# Altium project POVRotor.PrjPcb
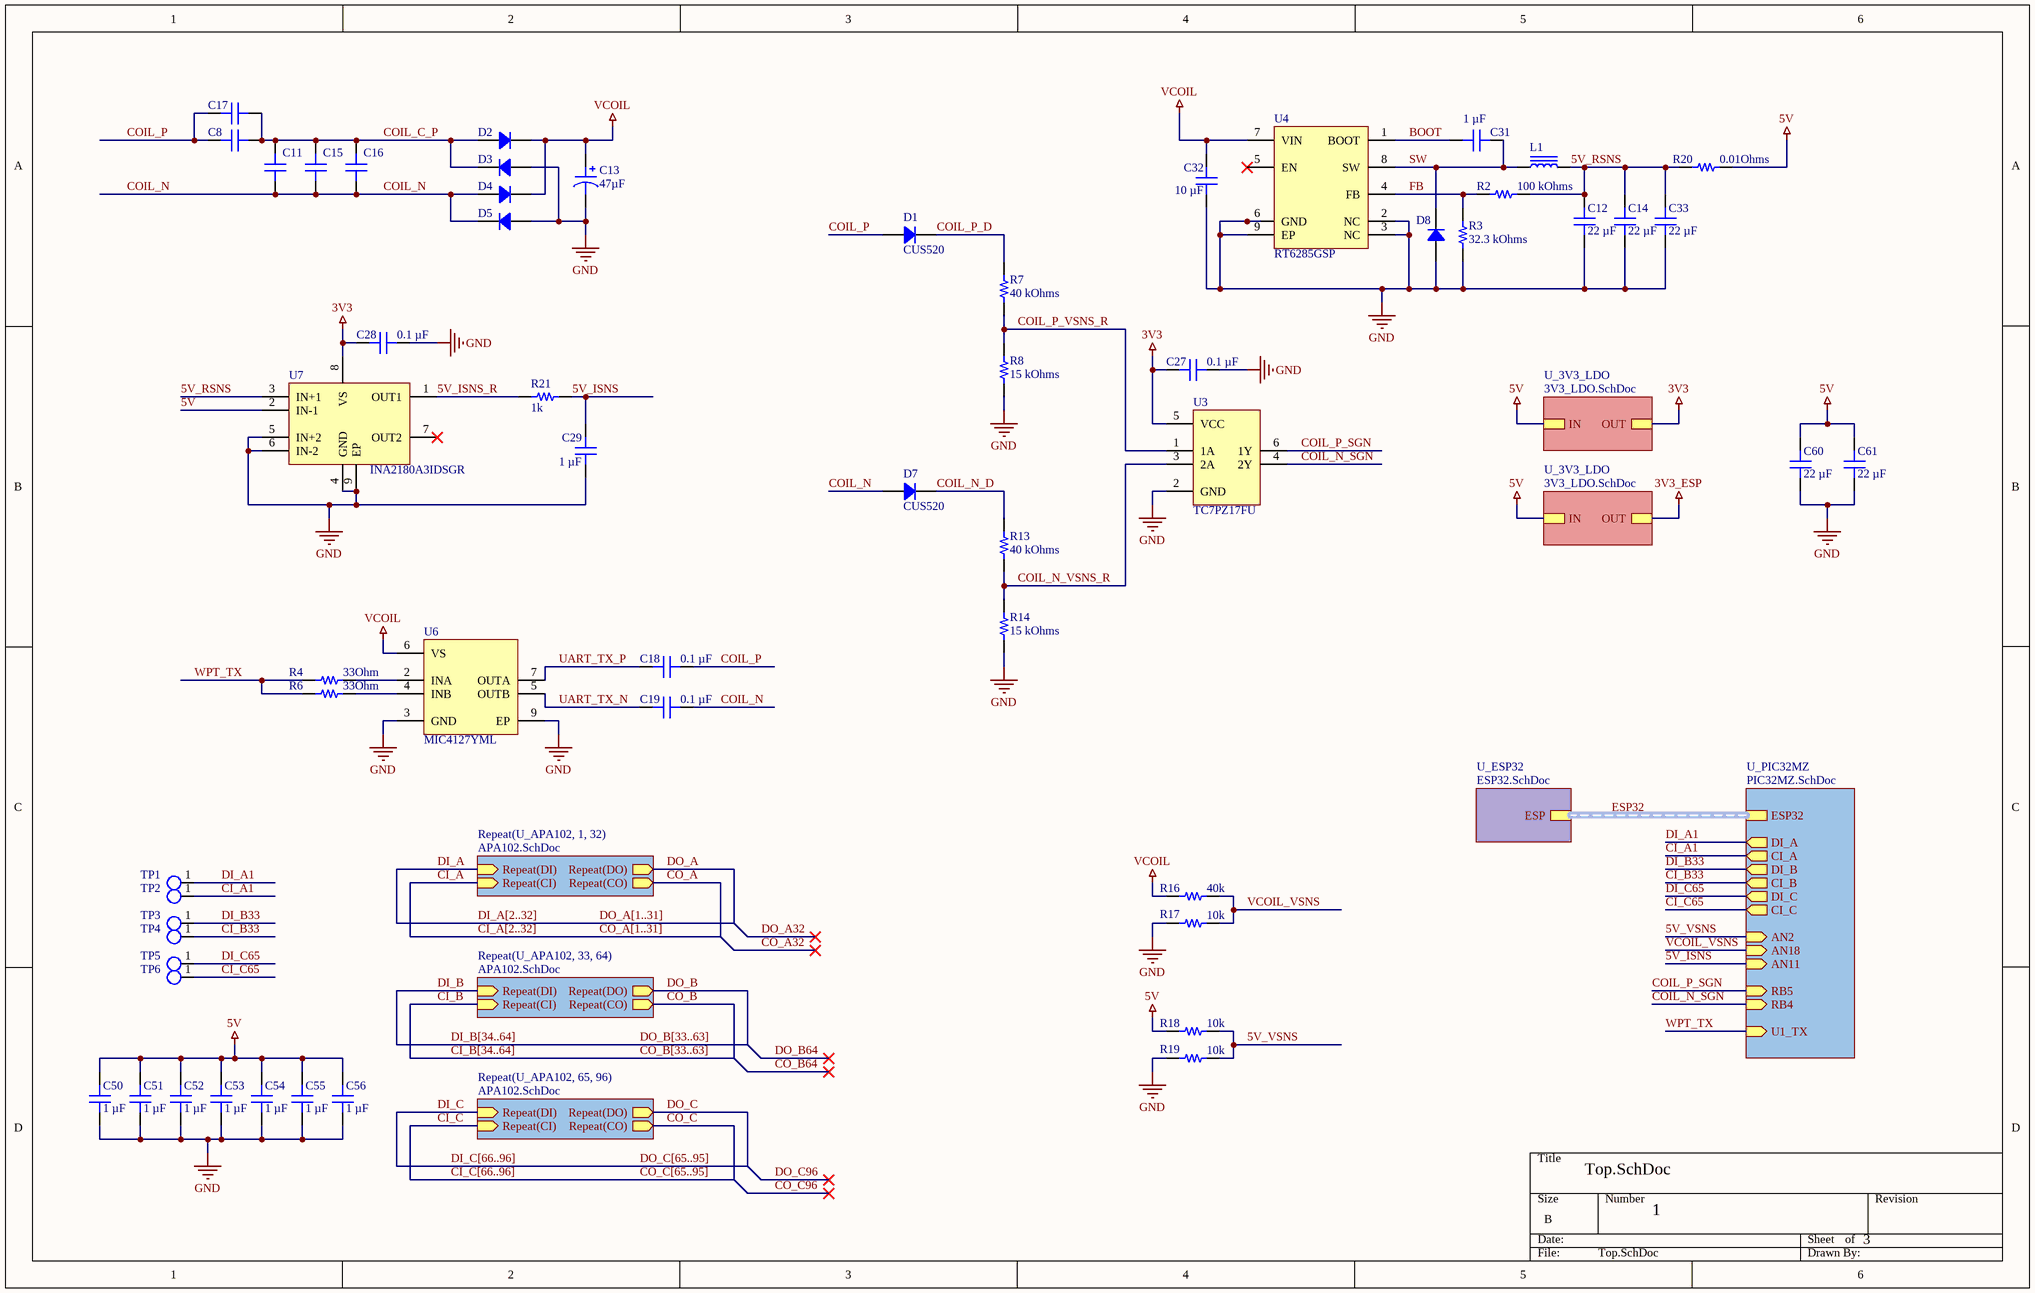
[diagram p0: Top.SchDoc]
4 sheets, 101 parts. Net scope: hierarchical (ports join the sheet entries above them; power ports are global).
Board file: POVRotor.PcbDoc
Sheets:
  Top.SchDoc
    U_ESP32 = ESP32.SchDoc
    U_PIC32MZ = PIC32MZ.SchDoc
    U_3V3_LDO = 3V3_LDO.SchDoc
    U_3V3_LDO = 3V3_LDO.SchDoc

## Sheet Top.SchDoc
size B; SheetNumber: 1; SheetTotal: 3

### Parts
C8  (no value)  [CAP 1206_3216 - 0.8MM]
C11  (no value)  [CAP 1206_3216 - 0.8MM]
C12  22 µF  [CAP 0603_1608]
C13  47µF  [CAP ALSMD 6.6MM H6.1MM]
C14  22 µF  [CAP 0603_1608]
C15  (no value)  [CAP 1206_3216 - 0.8MM]
C16  (no value)  [CAP 1206_3216 - 0.8MM]
C17  (no value)  [CAP 1206_3216 - 0.8MM]
C18  0.1 µF  [CAP 0402_1005]
C19  0.1 µF  [CAP 0402_1005]
C27  0.1 µF  [CAP 0402_1005]
C28  0.1 µF  [CAP 0402_1005]
C29  1 µF  [CAP 0402_1005]
C31  1 µF  [CAP 0402_1005]
C32  10 µF  [CAP 1210_3225 - 1MM]
C33  22 µF  [CAP 0603_1608]
C50  1 µF  [CAP 0402_1005]
C51  1 µF  [CAP 0402_1005]
C52  1 µF  [CAP 0402_1005]
C53  1 µF  [CAP 0402_1005]
C54  1 µF  [CAP 0402_1005]
C55  1 µF  [CAP 0402_1005]
C56  1 µF  [CAP 0402_1005]
C60  22 µF  [CAP 0603_1608]
C61  22 µF  [CAP 0603_1608]
D1  CUS520  [SOD323]
D2  STPS340UY  [DO214AA SMB]  (value not drawn)
D3  STPS340UY  [DO214AA SMB]  (value not drawn)
D4  STPS340UY  [DO214AA SMB]  (value not drawn)
D5  STPS340UY  [DO214AA SMB]  (value not drawn)
D7  CUS520  [SOD323]
D8  STPS340UY  [DO214AA SMB]  (value not drawn)
L1  MPL-AL5050-5R6  [MPL-AL5050-5R6]  (value not drawn)
R2  100 kOhms  [RES 0402_1005]
R3  32.3 kOhms  [RES 0402_1005]
R4  33Ohm  [RES 0402_1005]
R6  33Ohm  [RES 0402_1005]
R7  40 kOhms  [RES 0402_1005]
R8  15 kOhms  [RES 0402_1005]
R13  40 kOhms  [RES 0402_1005]
R14  15 kOhms  [RES 0402_1005]
R16  40k  [RES 0402_1005]
R17  10k  [RES 0402_1005]
R18  10k  [RES 0402_1005]
R19  10k  [RES 0402_1005]
R20  0.01Ohms  [RES 0805_2012]
R21  1k  [RES 0402_1005]
TP1  0.8mm  [TP  0.8mm]  (value not drawn)
TP2  0.8mm  [TP  0.8mm]  (value not drawn)
TP3  0.8mm  [TP  0.8mm]  (value not drawn)
TP4  0.8mm  [TP  0.8mm]  (value not drawn)
TP5  0.8mm  [TP  0.8mm]  (value not drawn)
TP6  0.8mm  [TP  0.8mm]  (value not drawn)
U3  TC7PZ17FU  [SOT-363]
U4  RT6285GSP  [8-SOIC Richtek]
U6  MIC4127YML  [VDFN-8 3x3x0.9]
U7  INA2180A3IDSGR  [SON50P200X200X80-9N]

### Sub-sheets
Repeat(U_APA102, 1, 32) = APA102.SchDoc (file not in this document): Repeat(DI) (in), Repeat(CI) (in), Repeat(CO) (out), Repeat(DO) (out)
Repeat(U_APA102, 33, 64) = APA102.SchDoc (file not in this document): Repeat(DI) (in), Repeat(CI) (in), Repeat(CO) (out), Repeat(DO) (out)
Repeat(U_APA102, 65, 96) = APA102.SchDoc (file not in this document): Repeat(DI) (in), Repeat(CI) (in), Repeat(CO) (out), Repeat(DO) (out)
U_3V3_LDO = 3V3_LDO.SchDoc: OUT, IN
U_3V3_LDO = 3V3_LDO.SchDoc: OUT, IN
U_ESP32 = ESP32.SchDoc: ESP (harness ESP)
U_PIC32MZ = PIC32MZ.SchDoc: ESP32 (harness ESP), DI_A (out), CI_A (out), DI_B (out), CI_B (out), DI_C (out), CI_C (out), AN18 (in), AN2 (in), RB5 (in), RB4 (in), AN11 (in), U1_TX (in)

### Nets
3V3: C27.2 C28.2 U3.5(VCC) U7.8(VS) ; sheet U_3V3_LDO/OUT
5V: C50.2 C51.2 C52.2 C53.2 C54.2 C55.2 C56.2 C60.2 C61.2 R18.2 R20.2 U7.2(IN-1) ; sheet U_3V3_LDO/IN, sheet U_3V3_LDO/IN
GND: C12.1 C13.2 C14.1 C27.1 C28.1 C29.2 C32.1 C33.1 C50.1 C51.1 C52.1 C53.1 C54.1 C55.1 C56.1 C60.1 C61.1 D3.1 D5.1 D8.1 R3.1 R8.1 R14.1 R17.2 R19.2 U3.2(GND) U4.2(NC) U4.3(NC) U4.6(GND) U4.9(EP) U6.3(GND) U6.9(EP) U7.4(GND) U7.5(IN+2) U7.6(IN-2) U7.9(EP)
VCOIL: C13.1 C32.2 D2.2 D4.2 R16.2 U4.7(VIN) U6.6(VS)
5V_ISNS: C29.1 R21.1 ; sheet U_PIC32MZ/AN11
5V_ISNS_R: R21.2 U7.1(OUT1)
5V_RSNS: C12.2 C14.2 C33.2 L1.2 R2.2 R20.1 U7.3(IN+1)
5V_VSNS: R18.1 R19.1 ; sheet U_PIC32MZ/AN2
BOOT: C31.2 U4.1(BOOT)
CI_A: sheet Repeat(U_APA102, 1, 32)/Repeat(CI)
CI_A1: TP2.1(TP) ; sheet U_PIC32MZ/CI_A
CI_B: sheet Repeat(U_APA102, 33, 64)/Repeat(CI)
CI_B33: TP4.1(TP) ; sheet U_PIC32MZ/CI_B
CI_C: sheet Repeat(U_APA102, 65, 96)/Repeat(CI)
CI_C65: TP6.1(TP) ; sheet U_PIC32MZ/CI_C
CO_A: sheet Repeat(U_APA102, 1, 32)/Repeat(CO)
CO_B: sheet Repeat(U_APA102, 33, 64)/Repeat(CO)
CO_C: sheet Repeat(U_APA102, 65, 96)/Repeat(CO)
COIL_C_P: C8.1 C11.2 C15.2 C16.2 C17.1 D2.1 D3.2
COIL_N: C11.1 C15.1 C16.1 C19.2 D4.1 D5.2 D7.1
COIL_N_D: D7.2 R13.2
COIL_N_SGN: U3.4(2Y) ; sheet U_PIC32MZ/RB4
COIL_N_VSNS_R: R13.1 R14.2 U3.3(2A)
COIL_P: C8.2 C17.2 C18.2 D1.1
COIL_P_D: D1.2 R7.2
COIL_P_SGN: U3.6(1Y) ; sheet U_PIC32MZ/RB5
COIL_P_VSNS_R: R7.1 R8.2 U3.1(1A)
DI_A: sheet Repeat(U_APA102, 1, 32)/Repeat(DI)
DI_A1: TP1.1(TP) ; sheet U_PIC32MZ/DI_A
DI_B: sheet Repeat(U_APA102, 33, 64)/Repeat(DI)
DI_B33: TP3.1(TP) ; sheet U_PIC32MZ/DI_B
DI_C: sheet Repeat(U_APA102, 65, 96)/Repeat(DI)
DI_C65: TP5.1(TP) ; sheet U_PIC32MZ/DI_C
DO_A: sheet Repeat(U_APA102, 1, 32)/Repeat(DO)
DO_B: sheet Repeat(U_APA102, 33, 64)/Repeat(DO)
DO_C: sheet Repeat(U_APA102, 65, 96)/Repeat(DO)
FB: R2.1 R3.2 U4.4(FB)
SW: C31.1 D8.2 L1.1 U4.8(SW)
UART_TX_N: C19.1 U6.5(OUTB)
UART_TX_P: C18.1 U6.7(OUTA)
VCOIL_VSNS: R16.1 R17.1 ; sheet U_PIC32MZ/AN18
WPT_TX: R4.1 R6.1 ; sheet U_PIC32MZ/U1_TX
NetR4_2: R4.2 U6.2(INA)
NetR6_2: R6.2 U6.4(INB)

Not connected (* = marked no-connect by the designer): U4 5(EN)*; U7 7(OUT2)*

### Buses and harness runs
bus CI_A[2..32] = CO_A[1..31]
bus CI_B[34..64] = CO_B[33..63]
bus CI_C[66..96] = CO_C[65..95]
bus DI_A[2..32] = DO_A[1..31]
bus DI_B[34..64] = DO_B[33..63]
bus DI_C[66..96] = DO_C[65..95]
harness ESP32 = sheet U_ESP32/ESP = sheet U_PIC32MZ/ESP32

### Library data of the parts
C8 C11 C15-C17 = C1206C223KBRAC7800: CAP CER 0.022UF 630V X7R 1206; manufacturer: KEMET; Capacitance: 0.022 µF; Tolerance: ±10%; Part Number: C1206C223KBRAC7800; Applications: General Purpose; componentlink1description: Datasheet; componentlink1url: https://api.kemet.com/component-edge/download/datasheet/C1206C223KBRAC7800.pdf; componentlink2description: DigiKey Link; componentlink2url: https://www.digikey.com/en/products/detail/kemet/C1206C223KBRAC7800/7382212; Device Package: 1206 (3216 Metric); Features: Low ESL, High Voltage; lastupdated: 9/29/2023 7:15:32 PM; Lifecycle Status: Active; Minimum Order: 1; Mounting Type: Surface Mount, MLCC; Operating Temperature: -55°C ~ 125°C; Package / Case: 1206 (3216 Metric); packaging: TapeAndReel; partid: 40769; Part Status: Active; price: 0.05; series: SMD Comm X7R HV; Size / Dimension: 0.126" L x 0.063" W (3.20mm x 1.60mm); Supplier 1: DigiKey; Supplier Part Number 1: 399-15097-1-ND; Temperature Coefficient: X7R; Thickness (Max): 0.075" (1.90mm); Voltage - Rated: 630V
C12 C14 C33 C60 C61 = 0603ZD226MAT2A: CAP CER 22UF 10V X5R 0603; manufacturer: KYOCERA AVX; Tolerance: ±20%; Part Number: 0603ZD226MAT2A; Value: 22 µF; Applications: General Purpose; Capacitance: 22 µF; componentlink2description: DigiKey Link; componentlink2url: https://www.digikey.com/en/products/detail/kyocera-avx/0603ZD226MAT2A/11268185; Device Package: 0603 (1608 Metric); lastupdated: 9/24/2023 7:08:40 PM; Lifecycle Status: Active; Minimum Order: 1; Mounting Type: Surface Mount, MLCC; Operating Temperature: -55°C ~ 85°C; Package / Case: 0603 (1608 Metric); packaging: TapeAndReel; partid: 35789; Part Status: Active; price: 0.13; series: -; Size / Dimension: 0.063" L x 0.032" W (1.60mm x 0.81mm); Supplier 1: DigiKey; Supplier Part Number 1: 478-0603ZD226MAT2ACT-ND; Temperature Coefficient: X5R; Thickness (Max): 0.035" (0.90mm); Voltage - Rated: 10V
C13 = EMHL160ARA470MF61G: ALUMINUM CAPACITOR; Manufacturer: United Chemi-Con; ESR (Equivalent Series Resistance): 1.2Ohm @ 100kHz; Lifetime @ Temp.: 2000 Hrs @ 125°C; Polarization: Polar; Ripple Current @ High Frequency: 110mA @ 100kHz; Ripple Current @ Low Frequency: 102.3mA @ 120Hz; Surface Mount Land Size: 0.260" L x 0.260" W (6.60mm x 6.60mm); Tolerance: ±20%; Voltage - Rated: 16V; Part Number: EMHL160ARA470MF61G; Applications: Automotive; Capacitance: 47µF; ComponentLink1Description: Datasheet; ComponentLink1URL: http://www.chemi-con.co.jp/cgi-bin/CAT_DB/SEARCH/cat_db_al.cgi?e=e&j=p&pdfname=mhl; ComponentLink2Description: DigiKey Link; ComponentLink2URL: http://digikey.com/product-detail/en/united-chemi-con/EMHL160ARA470MF61G/565-EMHL160ARA470MF61GCT-ND/10487181; Device Package: Radial, Can - SMD; Height - Seated (Max): 0.240" (6.10mm); LastUpdated: 9/2/2020 1:25:27 AM; Lifecycle Status: Active; Minimum Order: 1; Mounting Type: Surface Mount; Operating Temperature: -40°C ~ 125°C; Package / Case: Radial, Can - SMD; Packaging: TapeAndReel; PartId: 8133; Part Status: Active; Price: 0.15; Ratings: AEC-Q200; Series: AIchip™- MHL; Size / Dimension: 0.248" Dia (6.30mm); Supplier 1: DigiKey; Supplier Part Number 1: 565-EMHL160ARA470MF61GCT-ND; Value: 47µF
C18 C19 C27 C28 = C1005X5R1E104K050BC: CAP CER 0.1UF 25V X5R 0402; manufacturer: TDK Corporation; Tolerance: ±10%; Part Number: C1005X5R1E104K050BC; Value: 0.1 µF; Applications: General Purpose; Capacitance: 0.1 µF; componentlink1description: Datasheet; componentlink1url: https://product.tdk.com/info/en/catalog/datasheets/mlcc_commercial_general_en.pdf?ref_disty=digikey; componentlink2description: DigiKey Link; componentlink2url: https://www.digikey.com/en/products/detail/tdk-corporation/C1005X5R1E104K050BC/2093232; Device Package: 0402 (1005 Metric); Features: Low ESL; lastupdated: 9/24/2023 7:03:59 PM; Lifecycle Status: Active; Minimum Order: 1; Mounting Type: Surface Mount, MLCC; Operating Temperature: -55°C ~ 85°C; Package / Case: 0402 (1005 Metric); packaging: TapeAndReel; partid: 34396; Part Status: Active; price: 0.01; series: C; Size / Dimension: 0.039" L x 0.020" W (1.00mm x 0.50mm); Supplier 1: DigiKey; Supplier Part Number 1: 445-4964-1-ND; Temperature Coefficient: X5R; Thickness (Max): 0.022" (0.55mm); Voltage - Rated: 25V
C29 C31 = C1005X5R1E104K050BC: CAP CER 0.1UF 25V X5R 0402; manufacturer: TDK Corporation; Capacitance: 0.1 µF; Tolerance: ±10%; Part Number: C1005X5R1E104K050BC; Value: 1 µF; Applications: General Purpose; componentlink1description: Datasheet; componentlink1url: https://product.tdk.com/info/en/catalog/datasheets/mlcc_commercial_general_en.pdf?ref_disty=digikey; componentlink2description: DigiKey Link; componentlink2url: https://www.digikey.com/en/products/detail/tdk-corporation/C1005X5R1E104K050BC/2093232; Device Package: 0402 (1005 Metric); Features: Low ESL; lastupdated: 9/24/2023 7:03:59 PM; Lifecycle Status: Active; Minimum Order: 1; Mounting Type: Surface Mount, MLCC; Operating Temperature: -55°C ~ 85°C; Package / Case: 0402 (1005 Metric); packaging: TapeAndReel; partid: 34396; Part Status: Active; price: 0.01; series: C; Size / Dimension: 0.039" L x 0.020" W (1.00mm x 0.50mm); Supplier 1: DigiKey; Supplier Part Number 1: 445-4964-1-ND; Temperature Coefficient: X5R; Thickness (Max): 0.022" (0.55mm); Voltage - Rated: 25V
C32 = C1210X106K050T: CAP CER 10UF 50V X7R 1210; manufacturer: Holy Stone Enterprise Co., Ltd.; Tolerance: ±10%; Part Number: C1210X106K050T; Value: 10 µF; Applications: SMPS Filtering; Capacitance: 10 µF; componentlink1description: Datasheet; componentlink1url: https://www.holystonecaps.com/PDF/201612051328350.2017%20HCC%20Series.pdf; componentlink2description: DigiKey Link; componentlink2url: https://www.digikey.com/en/products/detail/holy-stone-enterprise-co-ltd/C1210X106K050T/16894866; Device Package: 1210 (3225 Metric); lastupdated: 10/13/2023 7:36:52 PM; Lifecycle Status: Active; Minimum Order: 1; Mounting Type: Surface Mount, MLCC; Operating Temperature: -55°C ~ 125°C; Package / Case: 1210 (3225 Metric); packaging: TapeAndReel; partid: 39935; Part Status: Active; price: 0.23; series: HCC; Size / Dimension: 0.126" L x 0.098" W (3.20mm x 2.50mm); Supplier 1: DigiKey; Supplier Part Number 1: 4587-C1210X106K050TCT-ND; Temperature Coefficient: X7R; Thickness (Max): 0.087" (2.20mm); Voltage - Rated: 50V
C50-C56 = GRM155R61C105MA12D: CAP CER 1UF 16V X5R 0402; manufacturer: Murata Electronics; Tolerance: ±20%; Part Number: GRM155R61C105MA12D; Value: 1 µF; Applications: General Purpose; Capacitance: 1 µF; componentlink1description: Datasheet; componentlink1url: https://search.murata.co.jp/Ceramy/image/img/A01X/G101/ENG/GRM155R61C105MA12-01.pdf; componentlink2description: DigiKey Link; componentlink2url: https://www.digikey.com/en/products/detail/murata-electronics/GRM155R61C105MA12D/4905131; Device Package: 0402 (1005 Metric); lastupdated: 9/24/2023 7:04:06 PM; Lifecycle Status: Active; Minimum Order: 1; Mounting Type: Surface Mount, MLCC; Operating Temperature: -55°C ~ 85°C; Package / Case: 0402 (1005 Metric); packaging: TapeAndReel; partid: 10295; Part Status: Active; price: 0.01; series: GRM; Size / Dimension: 0.039" L x 0.020" W (1.00mm x 0.50mm); Supplier 1: DigiKey; Supplier Part Number 1: 490-14599-1-ND; Temperature Coefficient: X5R; Thickness (Max): 0.022" (0.55mm); Voltage - Rated: 16V
D1 D7 = NSVRB751V40T1G: DIODE SCHOTTKY 30V 30MA SOD323; Manufacturer: ON Semiconductor; Capacitance @ Vr, F: 2.5pF @ 1V, 1MHz; Current - Average Rectified (Io): 30mA (DC); Current - Reverse Leakage @ Vr: 500nA @ 30V; Speed: Small Signal =< 200mA (Io), Any Speed; Voltage - DC Reverse (Vr) (Max): 40V; Voltage - Forward (Vf) (Max) @ If: 370mV @ 1mA; Part Number: NSVRB751V40T1G; ComponentLink1Description: Datasheet; ComponentLink1URL: https://www.onsemi.com/pub/Collateral/RB751V40T1-D.PDF; ComponentLink2Description: DigiKey Link; ComponentLink2URL: http://digikey.com/product-detail/en/on-semiconductor/NSVRB751V40T1G/NSVRB751V40T1GOSCT-ND/5969287; Diode Type: Schottky; LastUpdated: 9/30/2023 8:39:46 PM; Lifecycle Status: Active; Minimum Order: 1; Mounting Type: Surface Mount; Operating Temperature - Junction: -55°C ~ 150°C; Package / Case: SC-76, SOD-323; Packaging: TapeAndReel; PartId: 3084; Part Status: Active; Price: 0.12; Series: Automotive, AEC-Q101; Supplier 1: DigiKey; Supplier Part Number 1: NSVRB751V40T1GOSCT-ND; Supplier Device Package: SOD-323
D2-D5 D8 = STPS340UY: DIODE SCHOTTKY 40V 3A SMB; Manufacturer: STMicroelectronics; Current - Reverse Leakage @ Vr: 20µA @ 40V; Speed: Fast Recovery =< 500ns, > 200mA (Io); Voltage - Forward (Vf) (Max) @ If: 630mV @ 3A; Part Number: STPS340UY; ComponentLink1Description: Datasheet; ComponentLink1URL: http://www.st.com/content/ccc/resource/technical/document/datasheet/9d/f4/fa/9f/2c/39/45/91/CD00270569.pdf/files/CD00270569.pdf/jcr:content/translations/en.CD00270569.pdf; ComponentLink2Description: DigiKey Link; ComponentLink2URL: http://digikey.com/product-detail/en/stmicroelectronics/STPS340UY/497-13432-1-ND/3770079; Current - Average Rectified (Io): 3A; Diode Type: Schottky; LastUpdated: 9/2/2020 1:18:53 AM; Lifecycle Status: Active; Minimum Order: 1; Mounting Type: Surface Mount; Operating Temperature - Junction: -40°C ~ 150°C; Package / Case: DO-214AA, SMB; Packaging: TapeAndReel; PartId: 1402; Part Status: Active; Price: 0.30; Series: Automotive, AEC-Q101; Supplier 1: DigiKey; Supplier Part Number 1: 497-13432-1-ND; Supplier Device Package: SMB; Voltage - DC Reverse (Vr) (Max): 40V
L1 = MPL-AL5050-5R6: FIXED IND 5.6UH 6.8A 20 MOHM SMD; MF: Laird-Signal Integrity Products; MP: MGV05021R0M-10; SnapEDA_Link: https://www.snapeda.com/parts/MGV05021R0M-10/Laird/view-part/5881352/?ref=snap; Availability: In Stock; Purchase-URL: https://pricing.snapeda.com/search/part/MGV05021R0M-10/?ref=eda; Check_prices: https://www.snapeda.com/parts/MGV05021R0M-10/Laird/view-part/5881352/?ref=eda; Value: *; Package: Molded-2 Laird; Price: None
R2 R4 R6 = ESR01MZPJ224: RES SMD 220K OHM 5% 1/5W 0402; Manufacturer: Rohm Semiconductor; Power (Watts): 0.2W, 1/5W; Resistance: 220 kOhms; Temperature Coefficient: ±200ppm/°C; Part Number: ESR01MZPJ224; ComponentLink1Description: Datasheet; ComponentLink1URL: https://www.rohm.com/datasheet/ESR01MZPF/esr-e; ComponentLink2Description: DigiKey Link; ComponentLink2URL: https://www.digikey.com/en/products/detail/rohm-semiconductor/ESR01MZPJ224/4051160; Composition: Thick Film; Device Package: 0402 (1005 Metric); Features: Automotive AEC-Q200, Pulse Withstanding; Height - Seated (Max): 0.016" (0.40mm); LastUpdated: 9/24/2023 7:24:59 PM; Lifecycle Status: Active; Minimum Order: 1; Number of Terminations: 2; Operating Temperature: -55°C ~ 155°C; Package / Case: 0402 (1005 Metric); Packaging: TapeAndReel; PartId: 14678; Part Status: Active; Price: 0.03; Ratings: AEC-Q200; Series: ESR; Size / Dimension: 0.039" L x 0.020" W (1.00mm x 0.50mm); Supplier 1: DigiKey; Supplier Part Number 1: RHM1016CT-ND; Supplier Device Package: 0402; Tolerance: ±5%
  R2: Value: 100 kOhms
R3 R7 R8 R13 R14 R16-R19 R21 = RT0402DRE0730KL: RES SMD 30K OHM 0.5% 1/16W 0402; Manufacturer: Yageo; Power (Watts): 0.063W, 1/16W; Resistance: 30 kOhms; Temperature Coefficient: ±50ppm/°C; Part Number: RT0402DRE0730KL; ComponentLink1Description: Datasheet; ComponentLink1URL: https://www.yageo.com/upload/media/product/productsearch/datasheet/rchip/PYu-RT_1-to-0.01_RoHS_L_11.pdf; ComponentLink2Description: DigiKey Link; ComponentLink2URL: https://www.digikey.com/en/products/detail/yageo/RT0402DRE0730KL/1071471; Composition: Thin Film; Device Package: 0402 (1005 Metric); Height - Seated (Max): 0.014" (0.35mm); LastUpdated: 9/24/2023 7:25:39 PM; Lifecycle Status: Active; Minimum Order: 1; Number of Terminations: 2; Operating Temperature: -55°C ~ 155°C; Package / Case: 0402 (1005 Metric); Packaging: TapeAndReel; PartId: 4766; Part Status: Active; Price: 0.02; Series: RT; Size / Dimension: 0.039" L x 0.020" W (1.00mm x 0.50mm); Supplier 1: DigiKey; Supplier Part Number 1: 311-2271-1-ND; Supplier Device Package: 0402; Tolerance: ±0.5%
  R3: Value: 32.3 kOhms
  R7 R13: Value: 40 kOhms
  R8 R14: Value: 15 kOhms
  R16: Value: 40k
  R17-R19: Value: 10k
  R21: Value: 1k
R20 = ERJ-6CWDR027V: 0805 CURRENT SENSING RES. 0.5%,; Manufacturer: Panasonic Electronic Components; Value: 27 mOhms; Power (Watts): 0.5W, 1/2W; Temperature Coefficient: ±75ppm/°C; Part Number: ERJ-6CWDR027V; ComponentLink1Description: Datasheet; ComponentLink1URL: https://industrial.panasonic.com/cdbs/www-data/pdf/RDN0000/AOA0000C313.pdf; ComponentLink2Description: DigiKey Link; ComponentLink2URL: https://www.digikey.com/en/products/detail/panasonic-electronic-components/ERJ-6CWDR027V/10261704; Composition: Thick Film; Device Package: 0805 (2012 Metric); Features: Automotive AEC-Q200, Current Sense; Height - Seated (Max): 0.030" (0.75mm); LastUpdated: 10/1/2023 7:53:58 PM; Lifecycle Status: Active; Minimum Order: 1; Number of Terminations: 2; Operating Temperature: -55°C ~ 125°C; Package / Case: 0805 (2012 Metric); Packaging: TapeAndReel; PartId: 40402; Part Status: Active; Price: 0.13; Ratings: AEC-Q200; Resistance: 27 mOhms; Series: ERJ-6CW; Size / Dimension: 0.081" L x 0.051" W (2.05mm x 1.30mm); Supplier 1: DigiKey; Supplier Part Number 1: P124411CT-ND; Supplier Device Package: 0805; Tolerance: ±0.5%
TP1-TP6 = TP 0.8mm: Test point
U3 = TC7PZ17FU: 2x Buffer
U4 = RT6285GSP: Buck, Adj, 5A
U6 = MIC4127YML: Low side Gate Driver 2x
U7 = INA2180: Current sense amplifier 2 channel

## Sheet ESP32.SchDoc
size A; SheetNumber: 2; SheetTotal: 3
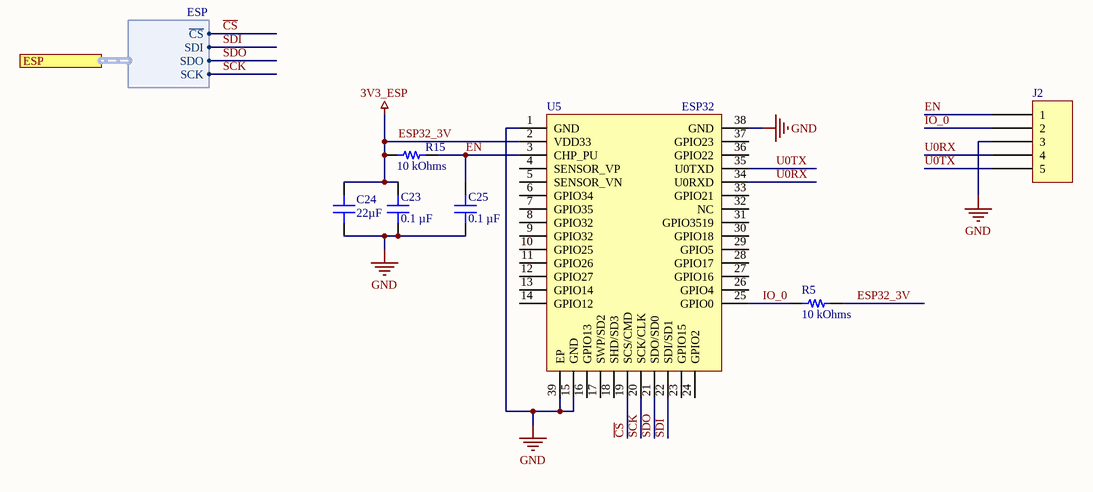
[diagram p1: ESP32.SchDoc]

### Parts
C23  0.1 µF  [CAP 0402_1005]
C24  22µF  [CAP 0805_2012]
C25  0.1 µF  [CAP 0402_1005]
J2  SM05B-SRSS-TB(LF)(SN)  [JST SM05B-SRSS-TB]  (value not drawn)
R5  10 kOhms  [RES 0402_1005]
R15  10 kOhms  [RES 0402_1005]
U5  ESP32  [Espressif ESP32-WROOM-32]

### Ports
ESP (harness ESP)

### Harnesses
ESP: ~{CS}, SDI, SDO, SCK

### Nets
3V3_ESP: C23.2 C24.2 R5.2 R15.1 U5.2(VDD33)  [also labelled ESP32_3V]
GND: C23.1 C24.1 C25.1 J2.3 U5.1(GND) U5.15(GND) U5.38(GND) U5.39(EP)
~{CS}: U5.19(SCS/CMD) ; port ESP.~{CS}  [project net ESP32.~{CS}]
EN: C25.2 J2.1 R15.2 U5.3(CHP_PU)
IO_0: J2.2 R5.1 U5.25(GPIO0)
SCK: U5.20(SCK/CLK) ; port ESP.SCK  [project net ESP32.SCK]
SDI: U5.22(SDI/SD1) ; port ESP.SDI  [project net ESP32.SDI]
SDO: U5.21(SDO/SD0) ; port ESP.SDO  [project net ESP32.SDO]
U0RX: J2.4 U5.34(U0RXD)
U0TX: J2.5 U5.35(U0TXD)

Not connected (* = marked no-connect by the designer): U5 4(SENSOR_VP) 5(SENSOR_VN) 6(GPIO34) 7(GPIO35) 8(GPIO32) 9(GPIO32) 10(GPIO25) 11(GPIO26) 12(GPIO27) 13(GPIO14) 14(GPIO12) 16(GPIO13) 17(SWP/SD2) 18(SHD/SD3) 23(GPIO15) 24(GPIO2) 26(GPIO4) 27(GPIO16) 28(GPIO17) 29(GPIO5) 30(GPIO18) 31(GPIO3519) 32(NC) 33(GPIO21) 36(GPIO22) 37(GPIO23)

### Library data of the parts
C23 C25 = C1005X5R1E104K050BC: as C18 on sheet Top; Part Number: C1005X5R1E104K050BC; Value: 0.1 µF; Applications: General Purpose; Capacitance: 0.1 µF; componentlink1description: Datasheet; componentlink1url: https://product.tdk.com/info/en/catalog/datasheets/mlcc_commercial_general_en.pdf?ref_disty=digikey; componentlink2description: DigiKey Link; componentlink2url: https://www.digikey.com/en/products/detail/tdk-corporation/C1005X5R1E104K050BC/2093232; Device Package: 0402 (1005 Metric); Features: Low ESL; lastupdated: 9/24/2023 7:03:59 PM; Lifecycle Status: Active; Minimum Order: 1; Mounting Type: Surface Mount, MLCC; Operating Temperature: -55°C ~ 85°C; Package / Case: 0402 (1005 Metric); packaging: TapeAndReel; partid: 34396; Part Status: Active; price: 0.01; series: C; Size / Dimension: 0.039" L x 0.020" W (1.00mm x 0.50mm); Supplier 1: DigiKey; Supplier Part Number 1: 445-4964-1-ND; Temperature Coefficient: X5R; Thickness (Max): 0.022" (0.55mm); Voltage - Rated: 25V
C24 = CL21A226MOQNNNE: CAP CER 22UF 16V X5R 0805; Manufacturer: Samsung Electro-Mechanics; Tolerance: ±20%; Part Number: CL21A226MOQNNNE; Value: 22µF; Applications: General Purpose; Capacitance: 22µF; ComponentLink1Description: Datasheet; ComponentLink1URL: http://www.samsungsem.com/kr/support/product-search/mlcc/CL21A226MOQNNNE.jsp; ComponentLink2Description: DigiKey Link; ComponentLink2URL: http://digikey.com/product-detail/en/samsung-electro-mechanics/CL21A226MOQNNNE/1276-2909-1-ND/3890995; Device Package: 0805 (2012 Metric); LastUpdated: 21-Jan-20 12:03:05 AM; Lifecycle Status: Active; Minimum Order: 1; Mounting Type: Surface Mount, MLCC; Operating Temperature: -55°C ~ 85°C; Package / Case: 0805 (2012 Metric); Packaging: TapeAndReel; PartId: 3052; Part Status: Active; Price: 0.11; Series: CL; Size / Dimension: 0.079" L x 0.049" W (2.00mm x 1.25mm); Supplier 1: DigiKey; Supplier Part Number 1: 1276-2909-1-ND; Temperature Coefficient: X5R; Thickness (Max): 0.055" (1.40mm); Voltage - Rated: 16V
J2 = SM05B-SRSS-TB(LF)(SN): CONN HEADER SMD R/A 5POS 1MM; Manufacturer: JST Sales America Inc.; Current Rating (Amps): 0.7A; Material Flammability Rating: UL94 V-0; Number of Positions: 5; Number of Positions Loaded: All; Pitch - Mating: 0.039" (1.00mm); Shrouding: Shrouded - 4 Wall; Style: Board to Cable/Wire; Voltage Rating: 50V; Part Number: SM05B-SRSS-TB(LF)(SN); ComponentLink1Description: Datasheet; ComponentLink1URL: http://www.jst-mfg.com/product/pdf/eng/eSH.pdf; ComponentLink2Description: DigiKey Link; ComponentLink2URL: http://digikey.com/product-detail/en/jst-sales-america-inc/SM05B-SRSS-TB-LF-SN/455-1805-1-ND/926876; Connector Type: Header; Contact Finish - Mating: Tin; Contact Finish - Post: Tin; Contact Material: Copper Alloy; Contact Shape: Square; Contact Type: Male Pin; Fastening Type: Push-Pull; Features: Solder Retention; Insulation Color: Natural; Insulation Height: 0.114" (2.90mm); Insulation Material: Polyamide (PA), Nylon; LastUpdated: 1/12/2020 11:42:04 PM; Lifecycle Status: Active; Minimum Order: 1; Mounting Type: Surface Mount, Right Angle; Number of Rows: 1; Operating Temperature: -25°C ~ 85°C; Packaging: TapeAndReel; PartId: 63; Part Status: Active; Price: 0.32; Series: SR; Supplier 1: DigiKey; Supplier Part Number 1: 455-1805-1-ND; Termination: Solder
R5 R15 = CRCW040210K0DHEDP: RES SMD 10K OHM 0.5% 1/16W 0402; Manufacturer: Vishay Dale; Power (Watts): 0.063W, 1/16W; Temperature Coefficient: ±50ppm/°C; Part Number: CRCW040210K0DHEDP; Value: 10 kOhms; ComponentLink1Description: Datasheet; ComponentLink1URL: http://www.vishay.com/docs/20036/dcrcwpe3.pdf; ComponentLink2Description: DigiKey Link; ComponentLink2URL: https://www.digikey.com/en/products/detail/vishay-dale/CRCW040210K0DHEDP/3593893; Composition: Thick Film; Device Package: 0402 (1005 Metric); Features: Automotive AEC-Q200; Height - Seated (Max): 0.016" (0.40mm); LastUpdated: 9/24/2023 7:25:38 PM; Lifecycle Status: Active; Minimum Order: 1; Number of Terminations: 2; Operating Temperature: -55°C ~ 155°C; Package / Case: 0402 (1005 Metric); Packaging: TapeAndReel; PartId: 5057; Part Status: Active; Price: 0.03; Ratings: AEC-Q200; Resistance: 10 kOhms; Series: CRCW-P; Size / Dimension: 0.039" L x 0.020" W (1.00mm x 0.50mm); Supplier 1: DigiKey; Supplier Part Number 1: 541-10KAVCT-ND; Supplier Device Package: 0402; Tolerance: ±0.5%

## Sheet PIC32MZ.SchDoc
size B; SheetNumber: 2; SheetTotal: 6
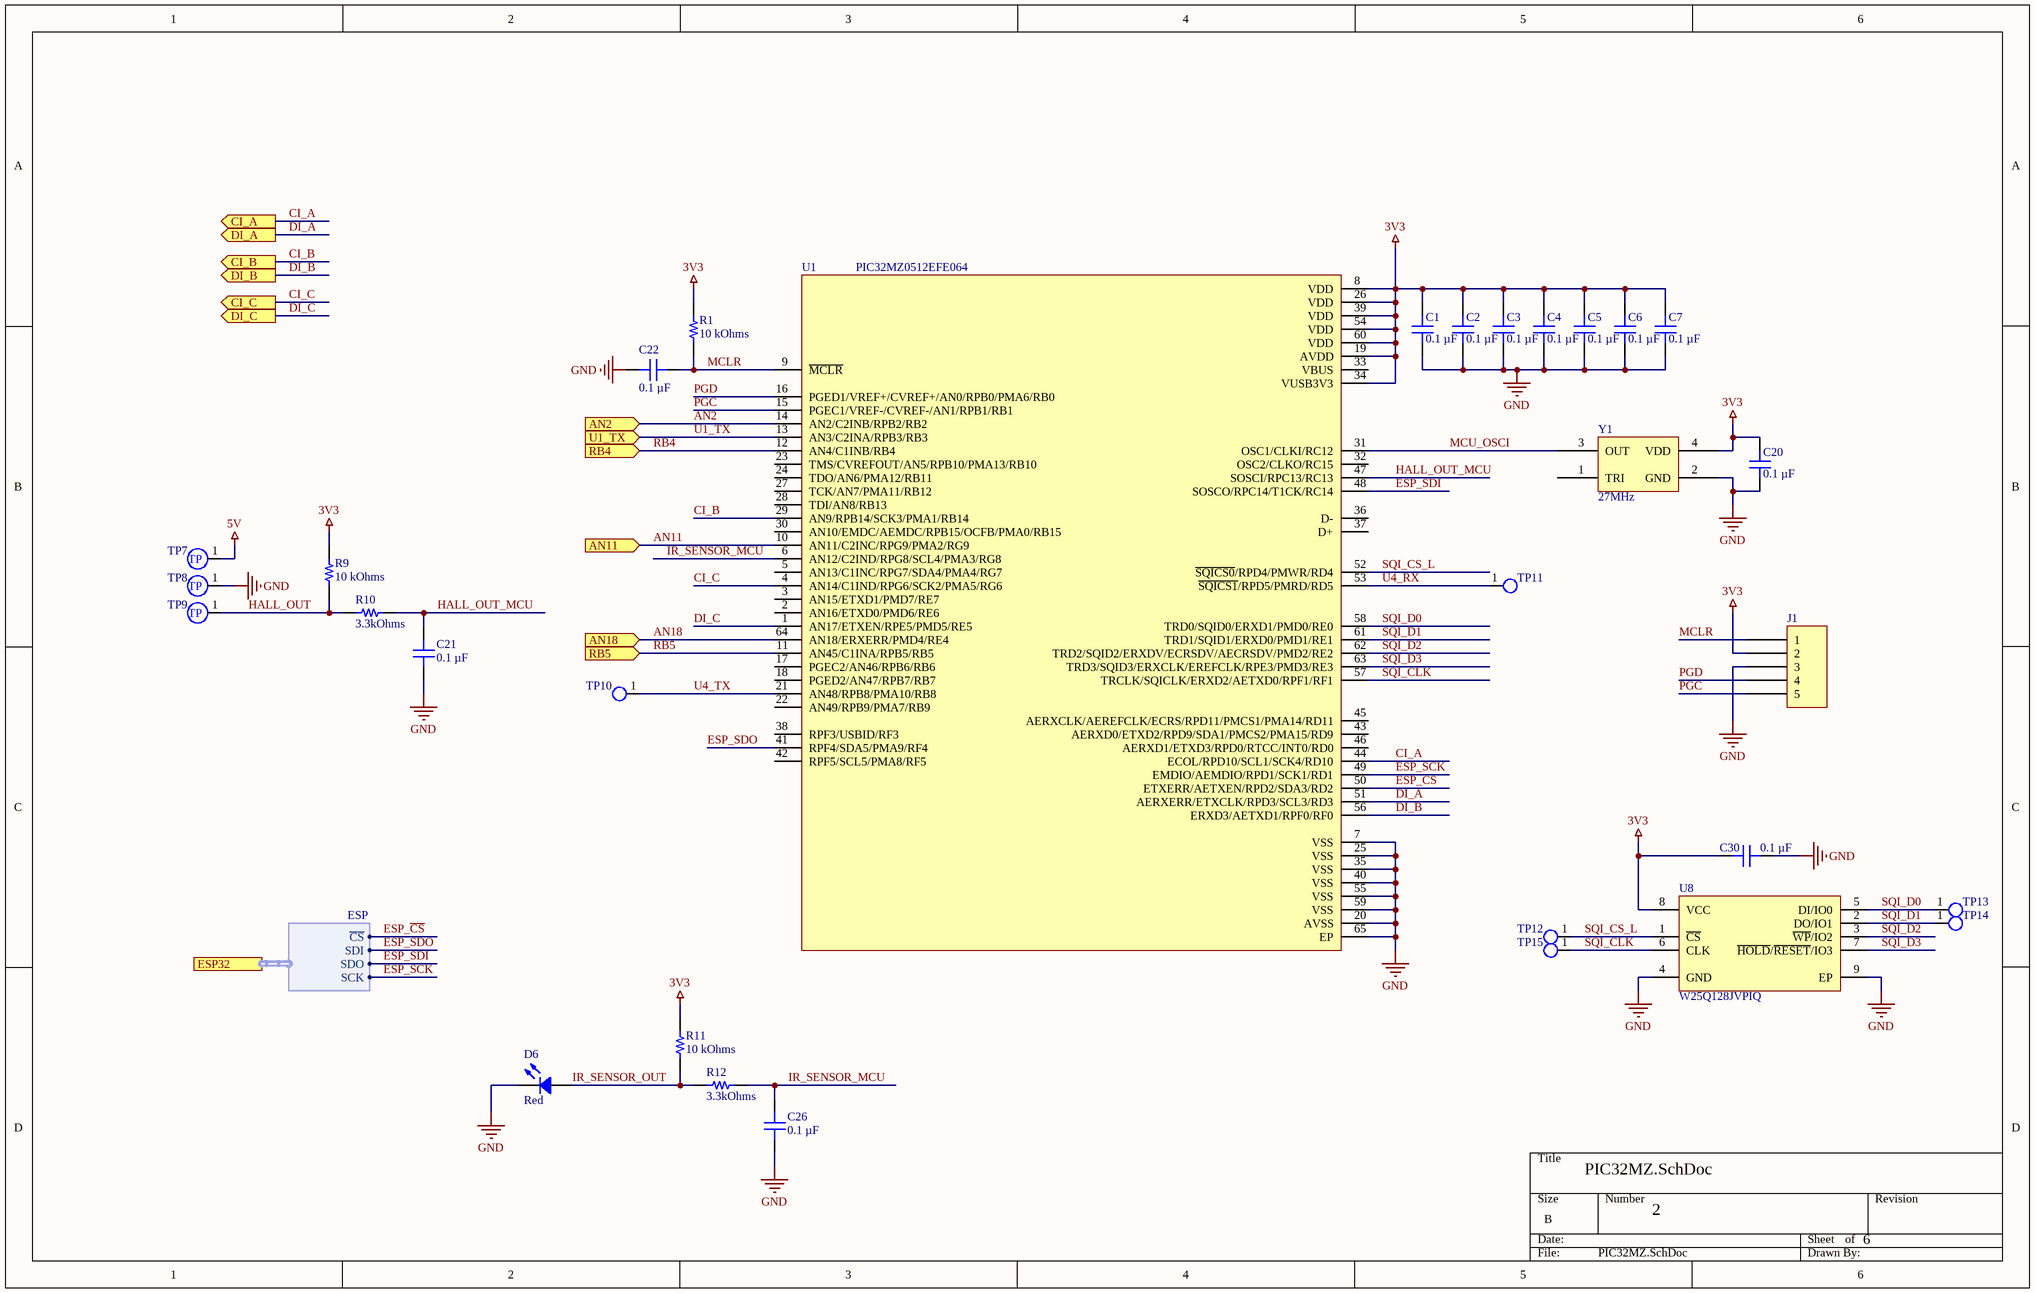
[diagram p2: PIC32MZ.SchDoc]

### Parts
C1  0.1 µF  [CAP 0402_1005]
C2  0.1 µF  [CAP 0402_1005]
C3  0.1 µF  [CAP 0402_1005]
C4  0.1 µF  [CAP 0402_1005]
C5  0.1 µF  [CAP 0402_1005]
C6  0.1 µF  [CAP 0402_1005]
C7  0.1 µF  [CAP 0402_1005]
C20  0.1 µF  [CAP 0402_1005]
C21  0.1 µF  [CAP 0402_1005]
C22  0.1 µF  [CAP 0402_1005]
C26  0.1 µF  [CAP 0402_1005]
C30  0.1 µF  [CAP 0402_1005]
D6  Red  [LED 0603_1608 RED]
J1  SM05B-SRSS-TB(LF)(SN)  [JST SM05B-SRSS-TB]  (value not drawn)
R1  10 kOhms  [RES 0402_1005]
R9  10 kOhms  [RES 0402_1005]
R10  3.3kOhms  [RES 0402_1005]
R11  10 kOhms  [RES 0402_1005]
R12  3.3kOhms  [RES 0402_1005]
TP7  TP  [TP]  (value not drawn)
TP8  TP  [TP]  (value not drawn)
TP9  TP  [TP]  (value not drawn)
TP10  0.8mm  [TP  0.8mm]  (value not drawn)
TP11  0.8mm  [TP  0.8mm]  (value not drawn)
TP12  0.8mm  [TP  0.8mm]  (value not drawn)
TP13  0.8mm  [TP  0.8mm]  (value not drawn)
TP14  0.8mm  [TP  0.8mm]  (value not drawn)
TP15  0.8mm  [TP  0.8mm]  (value not drawn)
U1  PIC32MZ0512EFE064  [QFN50P900X900X100-65N]
U8  W25Q128JVPIQ  [WSON-8 6x5 Winbond]
Y1  27MHz  [ABRACON ASD]

### Ports
AN2 (in), AN11 (in), AN18 (in), CI_A (out), CI_B (out), CI_C (out), DI_A (out), DI_B (out), DI_C (out), ESP32 (harness ESP), RB4 (in), RB5 (in), U1_TX (in)

### Harnesses
ESP: ~{CS}, SDI, SDO, SCK

### Nets
3V3: C1.2 C2.2 C3.2 C4.2 C5.2 C6.2 C7.2 C20.2 C30.2 J1.2 R1.2 R9.2 R11.2 U1.8(VDD) U1.19(AVDD) U1.26(VDD) U1.34(VUSB3V3) U1.39(VDD) U1.54(VDD) U1.60(VDD) U8.8(VCC) Y1.4(VDD)
5V: TP7.1(TP)
GND: C1.1 C2.1 C3.1 C4.1 C5.1 C6.1 C7.1 C20.1 C21.2 C22.1 C26.2 C30.1 D6.2 J1.3 TP8.1(TP) U1.7(VSS) U1.20(AVSS) U1.25(VSS) U1.35(VSS) U1.40(VSS) U1.55(VSS) U1.59(VSS) U1.65(EP) U8.4(GND) U8.9(EP) Y1.2(GND)
AN2: U1.14(AN2/C2INB/RPB2/RB2) ; port AN2  [project net 5V_VSNS]
AN11: U1.10(AN11/C2INC/RPG9/PMA2/RG9) ; port AN11  [project net 5V_ISNS]
AN18: U1.64(AN18/ERXERR/PMD4/RE4) ; port AN18  [project net VCOIL_VSNS]
CI_A: U1.44(ECOL/RPD10/SCL1/SCK4/RD10) ; port CI_A  [project net CI_A1]
CI_B: U1.29(AN9/RPB14/SCK3/PMA1/RB14) ; port CI_B  [project net CI_B33]
CI_C: U1.4(AN14/C1IND/RPG6/SCK2/PMA5/RG6) ; port CI_C  [project net CI_C65]
DI_A: U1.51(AERXERR/ETXCLK/RPD3/SCL3/RD3) ; port DI_A  [project net DI_A1]
DI_B: U1.56(ERXD3/AETXD1/RPF0/RF0) ; port DI_B  [project net DI_B33]
DI_C: U1.1(AN17/ETXEN/RPE5/PMD5/RE5) ; port DI_C  [project net DI_C65]
ESP_~{CS}: U1.50(ETXERR/AETXEN/RPD2/SDA3/RD2) ; port ESP32.~{CS}  [project net ESP32.~{CS}]
ESP_SCK: U1.49(EMDIO/AEMDIO/RPD1/SCK1/RD1) ; port ESP32.SCK  [project net ESP32.SCK]
ESP_SDI: U1.48(SOSCO/RPC14/T1CK/RC14) ; port ESP32.SDO  [project net ESP32.SDO]
ESP_SDO: U1.41(RPF4/SDA5/PMA9/RF4) ; port ESP32.SDI  [project net ESP32.SDI]
HALL_OUT: R9.1 R10.2 TP9.1(TP)
HALL_OUT_MCU: C21.1 R10.1 U1.47(SOSCI/RPC13/RC13)
IR_SENSOR_MCU: C26.1 R12.1 U1.6(AN12/C2IND/RPG8/SCL4/PMA3/RG8)
IR_SENSOR_OUT: D6.1 R11.1 R12.2
MCLR: C22.2 J1.1 R1.1 U1.9(~{MCLR})
MCU_OSCI: U1.31(OSC1/CLKI/RC12) Y1.3(OUT)
PGC: J1.5 U1.15(PGEC1/VREF-/CVREF-/AN1/RPB1/RB1)
PGD: J1.4 U1.16(PGED1/VREF+/CVREF+/AN0/RPB0/PMA6/RB0)
RB4: U1.12(AN4/C1INB/RB4) ; port RB4  [project net COIL_N_SGN]
RB5: U1.11(AN45/C1INA/RPB5/RB5) ; port RB5  [project net COIL_P_SGN]
SQI_CLK: TP15.1(TP) U1.57(TRCLK/SQICLK/ERXD2/AETXD0/RPF1/RF1) U8.6(CLK)
SQI_CS_L: TP12.1(TP) U1.52(~{SQICS0}/RPD4/PMWR/RD4) U8.1(~{CS})
SQI_D0: TP13.1(TP) U1.58(TRD0/SQID0/ERXD1/PMD0/RE0) U8.5(DI/IO0)
SQI_D1: TP14.1(TP) U1.61(TRD1/SQID1/ERXD0/PMD1/RE1) U8.2(DO/IO1)
SQI_D2: U1.62(TRD2/SQID2/ERXDV/ECRSDV/AECRSDV/PMD2/RE2) U8.3(~{WP}/IO2)
SQI_D3: U1.63(TRD3/SQID3/ERXCLK/EREFCLK/RPE3/PMD3/RE3) U8.7(~{HOLD}/~{RESET}/IO3)
U1_TX: U1.13(AN3/C2INA/RPB3/RB3) ; port U1_TX  [project net WPT_TX]
U4_RX: TP11.1(TP) U1.53(~{SQICS1}/RPD5/PMRD/RD5)
U4_TX: TP10.1(TP) U1.21(AN48/RPB8/PMA10/RB8)

Not connected (* = marked no-connect by the designer): U1 2(AN16/ETXD0/PMD6/RE6) 3(AN15/ETXD1/PMD7/RE7) 5(AN13/C1INC/RPG7/SDA4/PMA4/RG7) 17(PGEC2/AN46/RPB6/RB6) 18(PGED2/AN47/RPB7/RB7) 22(AN49/RPB9/PMA7/RB9) 23(TMS/CVREFOUT/AN5/RPB10/PMA13/RB10) 24(TDO/AN6/PMA12/RB11) 27(TCK/AN7/PMA11/RB12) 28(TDI/AN8/RB13) 30(AN10/EMDC/AEMDC/RPB15/OCFB/PMA0/RB15) 32(OSC2/CLKO/RC15) 33(VBUS) 36(D-) 37(D+) 38(RPF3/USBID/RF3) 42(RPF5/SCL5/PMA8/RF5) 43(AERXD0/ETXD2/RPD9/SDA1/PMCS2/PMA15/RD9) 45(AERXCLK/AEREFCLK/ECRS/RPD11/PMCS1/PMA14/RD11) 46(AERXD1/ETXD3/RPD0/RTCC/INT0/RD0); Y1 1(TRI)

### Library data of the parts
C1-C7 C21 C22 C26 C30 = C1005X5R1E104K050BC: as C18 on sheet Top; Part Number: C1005X5R1E104K050BC; Value: 0.1 µF; Applications: General Purpose; Capacitance: 0.1 µF; componentlink1description: Datasheet; componentlink1url: https://product.tdk.com/info/en/catalog/datasheets/mlcc_commercial_general_en.pdf?ref_disty=digikey; componentlink2description: DigiKey Link; componentlink2url: https://www.digikey.com/en/products/detail/tdk-corporation/C1005X5R1E104K050BC/2093232; Device Package: 0402 (1005 Metric); Features: Low ESL; lastupdated: 9/24/2023 7:03:59 PM; Lifecycle Status: Active; Minimum Order: 1; Mounting Type: Surface Mount, MLCC; Operating Temperature: -55°C ~ 85°C; Package / Case: 0402 (1005 Metric); packaging: TapeAndReel; partid: 34396; Part Status: Active; price: 0.01; series: C; Size / Dimension: 0.039" L x 0.020" W (1.00mm x 0.50mm); Supplier 1: DigiKey; Supplier Part Number 1: 445-4964-1-ND; Temperature Coefficient: X5R; Thickness (Max): 0.022" (0.55mm); Voltage - Rated: 25V
C20 = C0402C104K4RACAUTO: CAP CER 0.1UF 16V X7R 0402; manufacturer: KEMET; Tolerance: ±10%; Part Number: C0402C104K4RACAUTO; Value: 0.1 µF; Applications: Automotive, Bypass, Decoupling; Capacitance: 0.1 µF; componentlink1description: Datasheet; componentlink1url: https://api.kemet.com/component-edge/download/specsheet/C0402C104K4RACAUTO.pdf; componentlink2description: DigiKey Link; componentlink2url: https://www.digikey.com/en/products/detail/kemet/C0402C104K4RACAUTO/3314827; Device Package: 0402 (1005 Metric); lastupdated: 8/14/2022 9:05:51 PM; Lifecycle Status: Active; Minimum Order: 1; Mounting Type: Surface Mount, MLCC; Operating Temperature: -55°C ~ 125°C; Package / Case: 0402 (1005 Metric); packaging: TapeAndReel; partid: 3024; Part Status: Active; price: 0.01; Ratings: AEC-Q200; series: SMD Auto X7R; Size / Dimension: 0.039" L x 0.020" W (1.00mm x 0.50mm); Supplier 1: DigiKey; Supplier Part Number 1: 399-6828-1-ND; Temperature Coefficient: X7R; Thickness (Max): 0.022" (0.55mm); Voltage - Rated: 16V
D6 = 5988010107F: LED RED CLEAR 0603 SMD; Manufacturer: Dialight; Configuration: Standard; Current - Test: 20mA; Lens Color: Colorless; Lens Size: 1.10mm x 0.80mm; Lens Style: Rectangle with Flat Top; Millicandela Rating: 60mcd; Viewing Angle: 140°; Voltage - Forward (Vf) (Typ): 2V; Wavelength - Dominant: 635nm; Part Number: 5988010107F; Color: Red; ComponentLink1Description: Datasheet; ComponentLink1URL: //media.digikey.com/pdf/Data%20Sheets/Dialight%20PDFs/598_Series_0603_Pkg.pdf; ComponentLink2Description: DigiKey Link; ComponentLink2URL: https://www.digikey.com/en/products/detail/dialight/5988010107F/1291263; Device Package: 0603 (1608 Metric); Height (Max): 0.70mm; LastUpdated: 9/30/2023 8:22:05 PM; Lens Transparency: Clear; Lifecycle Status: Active; Minimum Order: 1; Mounting Type: Surface Mount; Package / Case: 0603 (1608 Metric); Packaging: TapeAndReel; PartId: 460; Part Status: Active; Price: 0.05; Series: 598; Size / Dimension: 1.60mm L x 0.80mm W; Supplier 1: DigiKey; Supplier Part Number 1: 350-2029-1-ND; Supplier Device Package: 0603; Value: Red
J1 = SM05B-SRSS-TB(LF)(SN): as J2 on sheet ESP32; Part Number: SM05B-SRSS-TB(LF)(SN); ComponentLink1Description: Datasheet; ComponentLink1URL: http://www.jst-mfg.com/product/pdf/eng/eSH.pdf; ComponentLink2Description: DigiKey Link; ComponentLink2URL: http://digikey.com/product-detail/en/jst-sales-america-inc/SM05B-SRSS-TB-LF-SN/455-1805-1-ND/926876; Connector Type: Header; Contact Finish - Mating: Tin; Contact Finish - Post: Tin; Contact Material: Copper Alloy; Contact Shape: Square; Contact Type: Male Pin; Fastening Type: Push-Pull; Features: Solder Retention; Insulation Color: Natural; Insulation Height: 0.114" (2.90mm); Insulation Material: Polyamide (PA), Nylon; LastUpdated: 1/12/2020 11:42:04 PM; Lifecycle Status: Active; Minimum Order: 1; Mounting Type: Surface Mount, Right Angle; Number of Rows: 1; Operating Temperature: -25°C ~ 85°C; Packaging: TapeAndReel; PartId: 63; Part Status: Active; Price: 0.32; Series: SR; Supplier 1: DigiKey; Supplier Part Number 1: 455-1805-1-ND; Termination: Solder
R1 R9 R11 = CRCW040210K0DHEDP: as R5 on sheet ESP32; Part Number: CRCW040210K0DHEDP; Value: 10 kOhms; ComponentLink1Description: Datasheet; ComponentLink1URL: http://www.vishay.com/docs/20036/dcrcwpe3.pdf; ComponentLink2Description: DigiKey Link; ComponentLink2URL: https://www.digikey.com/en/products/detail/vishay-dale/CRCW040210K0DHEDP/3593893; Composition: Thick Film; Device Package: 0402 (1005 Metric); Features: Automotive AEC-Q200; Height - Seated (Max): 0.016" (0.40mm); LastUpdated: 9/24/2023 7:25:38 PM; Lifecycle Status: Active; Minimum Order: 1; Number of Terminations: 2; Operating Temperature: -55°C ~ 155°C; Package / Case: 0402 (1005 Metric); Packaging: TapeAndReel; PartId: 5057; Part Status: Active; Price: 0.03; Ratings: AEC-Q200; Resistance: 10 kOhms; Series: CRCW-P; Size / Dimension: 0.039" L x 0.020" W (1.00mm x 0.50mm); Supplier 1: DigiKey; Supplier Part Number 1: 541-10KAVCT-ND; Supplier Device Package: 0402; Tolerance: ±0.5%
R10 R12 = CRCW040210K0DHEDP: RES SMD 10K OHM 0.5% 1/16W 0402; Manufacturer: Vishay Dale; Power (Watts): 0.063W, 1/16W; Resistance: 10 kOhms; Temperature Coefficient: ±50ppm/°C; Part Number: CRCW040210K0DHEDP; Value: 3.3kOhms; ComponentLink1Description: Datasheet; ComponentLink1URL: http://www.vishay.com/docs/20036/dcrcwpe3.pdf; ComponentLink2Description: DigiKey Link; ComponentLink2URL: https://www.digikey.com/en/products/detail/vishay-dale/CRCW040210K0DHEDP/3593893; Composition: Thick Film; Device Package: 0402 (1005 Metric); Features: Automotive AEC-Q200; Height - Seated (Max): 0.016" (0.40mm); LastUpdated: 9/24/2023 7:25:38 PM; Lifecycle Status: Active; Minimum Order: 1; Number of Terminations: 2; Operating Temperature: -55°C ~ 155°C; Package / Case: 0402 (1005 Metric); Packaging: TapeAndReel; PartId: 5057; Part Status: Active; Price: 0.03; Ratings: AEC-Q200; Series: CRCW-P; Size / Dimension: 0.039" L x 0.020" W (1.00mm x 0.50mm); Supplier 1: DigiKey; Supplier Part Number 1: 541-10KAVCT-ND; Supplier Device Package: 0402; Tolerance: ±0.5%
TP7-TP9 = TP: Test point
TP10-TP15 = TP 0.8mm: Test point
U1 = PIC32MZ0512EFE064-I/PT: 32-bit Microcontrollers - MCU 32-BIT MCU 512KB FL 128KB RAM, No Crypto; MF: Microchip; MP: PIC32MZ2048EFG064T-I/PT; Price: None; Value: *; SnapEDA_Link: https://www.snapeda.com/parts/PIC32MZ2048EFG064T-I/PT/Microchip/view-part/565997/?ref=snap; Package: TQFP-64 Microchip; Availability: Unavailable
U8 = W25Q128JVPIQ: Quad SPI FLASH 16MB
Y1 = ASD3-27.000MHZ-EC-T: XTAL OSC XO 27.0000MHZ HCMOS SMD; Manufacturer: Abracon LLC; Base Resonator: Crystal; Current - Supply (Max): 4mA; Frequency Stability: ±50ppm; Function: Enable/Disable; Voltage - Supply: 1.8V; Part Number: ASD3-27.000MHZ-EC-T; ComponentLink1Description: Datasheet; ComponentLink1URL: https://abracon.com/Oscillators/ASDseries.pdf; ComponentLink2Description: DigiKey Link; ComponentLink2URL: http://digikey.com/product-detail/en/abracon-llc/ASD3-27.000MHZ-EC-T/535-9608-1-ND/1237075; Frequency: 27MHz; Height - Seated (Max): 0.039" (1.00mm); LastUpdated: 9/14/2022 8:37:45 AM; Lifecycle Status: Active; Minimum Order: 1; Mounting Type: Surface Mount; Operating Temperature: -20°C ~ 70°C; Output: HCMOS; Package / Case: 4-SMD, No Lead; Packaging: TapeAndReel; PartId: 4; Part Status: Active; Price: 1.74; Series: ASD; Size / Dimension: 0.098" L x 0.079" W (2.50mm x 2.00mm); Supplier 1: DigiKey; Supplier Part Number 1: 535-9608-1-ND; Type: XO (Standard); Value: 27MHz

## Sheet 3V3_LDO.SchDoc
size A; SheetNumber: 3; SheetTotal: 6
Used 2 times, as channels U_3V3_LDO, U_3V3_LDO. Parts and nets are listed once, with the designators drawn on the sheet.
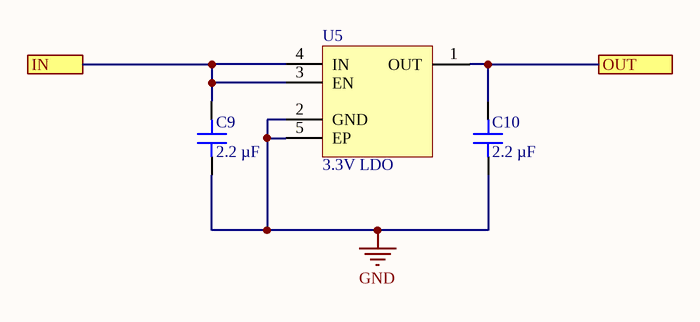
[diagram p3: 3V3_LDO.SchDoc]

### Parts
C9  2.2 µF  [CAP 0402_1005]
C10  2.2 µF  [CAP 0402_1005]
U5  3.3V LDO  [XDFN-4]

### Ports
IN, OUT

### Nets
GND: C9.1 C10.1 U5.2(GND) U5.5(EP)
IN: C9.2 U5.3(EN) U5.4(IN) ; port IN
OUT: C10.2 U5.1(OUT) ; port OUT

### Channels
U_3V3_LDO: designators end in _1; ports IN=5V OUT=3V3
U_3V3_LDO: designators end in _2; ports IN=5V OUT=3V3_ESP

### Library data of the parts
C9 C10 = C0402C104K4RACAUTO: CAP CER 0.1UF 16V X7R 0402; manufacturer: KEMET; Capacitance: 0.1 µF; Tolerance: ±10%; Part Number: C0402C104K4RACAUTO; Value: 2.2 µF; Applications: Automotive, Bypass, Decoupling; componentlink1description: Datasheet; componentlink1url: https://api.kemet.com/component-edge/download/specsheet/C0402C104K4RACAUTO.pdf; componentlink2description: DigiKey Link; componentlink2url: https://www.digikey.com/en/products/detail/kemet/C0402C104K4RACAUTO/3314827; Device Package: 0402 (1005 Metric); lastupdated: 8/14/2022 9:05:51 PM; Lifecycle Status: Active; Minimum Order: 1; Mounting Type: Surface Mount, MLCC; Operating Temperature: -55°C ~ 125°C; Package / Case: 0402 (1005 Metric); packaging: TapeAndReel; partid: 3024; Part Status: Active; price: 0.01; Ratings: AEC-Q200; series: SMD Auto X7R; Size / Dimension: 0.039" L x 0.020" W (1.00mm x 0.50mm); Supplier 1: DigiKey; Supplier Part Number 1: 399-6828-1-ND; Temperature Coefficient: X7R; Thickness (Max): 0.022" (0.55mm); Voltage - Rated: 16V
U5 = TLV74033PDQNR

## Nets that join several sheets
3V3: Top (C27.2 C28.2 U3.5 U7.8), PIC32MZ (22 pins), U_3V3_LDO (C10_1.2 U5_1.1)
3V3_ESP: ESP32 (5 pins), U_3V3_LDO (C10_2.2 U5_2.1)
5V: Top (12 pins), PIC32MZ (TP7.1), U_3V3_LDO (C9_1.2 U5_1.3 U5_1.4), U_3V3_LDO (C9_2.2 U5_2.3 U5_2.4)
GND: Top (36 pins), ESP32 (8 pins), PIC32MZ (26 pins), U_3V3_LDO (C9_1.1 C10_1.1 U5_1.2 U5_1.5), U_3V3_LDO (C9_2.1 C10_2.1 U5_2.2 U5_2.5)
5V_ISNS: Top (C29.1 R21.1), PIC32MZ (U1.10)
5V_VSNS: Top (R18.1 R19.1), PIC32MZ (U1.14)
CI_A1: Top (TP2.1), PIC32MZ (U1.44)
CI_B33: Top (TP4.1), PIC32MZ (U1.29)
CI_C65: Top (TP6.1), PIC32MZ (U1.4)
COIL_N_SGN: Top (U3.4), PIC32MZ (U1.12)
COIL_P_SGN: Top (U3.6), PIC32MZ (U1.11)
DI_A1: Top (TP1.1), PIC32MZ (U1.51)
DI_B33: Top (TP3.1), PIC32MZ (U1.56)
DI_C65: Top (TP5.1), PIC32MZ (U1.1)
ESP32.~{CS}: ESP32 (U5.19), PIC32MZ (U1.50)
ESP32.SCK: ESP32 (U5.20), PIC32MZ (U1.49)
ESP32.SDI: ESP32 (U5.22), PIC32MZ (U1.41)
ESP32.SDO: ESP32 (U5.21), PIC32MZ (U1.48)
VCOIL_VSNS: Top (R16.1 R17.1), PIC32MZ (U1.64)
WPT_TX: Top (R4.1 R6.1), PIC32MZ (U1.13)

## Assembly variants
Main: not fitted JU1 JU2 JU3 JU4 JU5 JU6 JU7